# EAGLE design thtV1.0 (EAGLE 7.4.0)
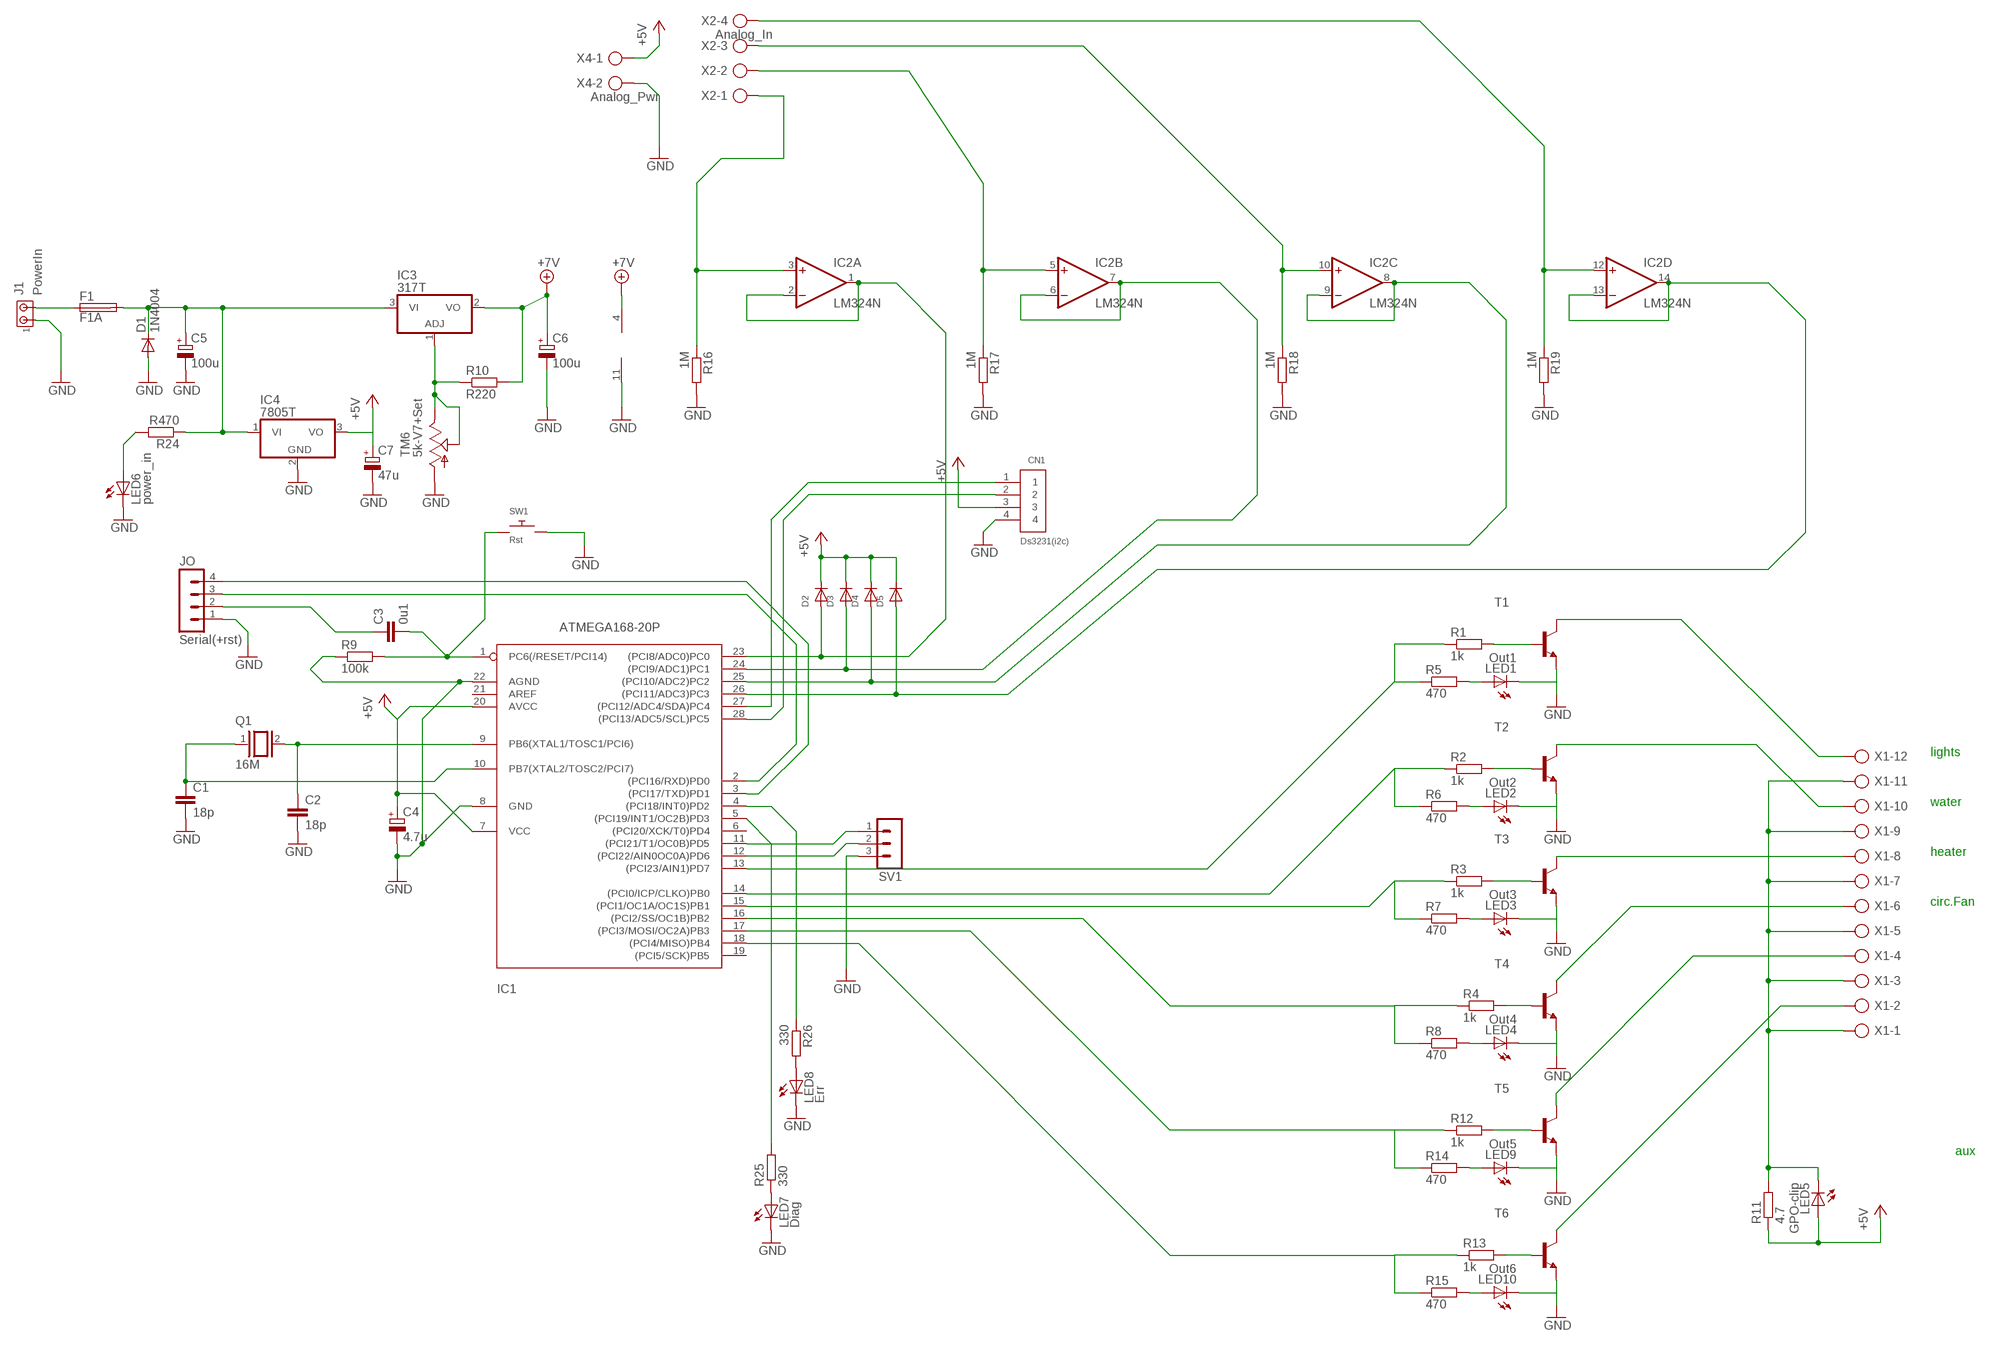
[diagram p0: schematic, sheet 1]

## Parts
C1  18p  C-EU025-024X044  [C025-024X044]
C2  18p  C-EU025-024X044  [C025-024X044]
C3  0u1  C-EU050-030X075  [C050-030X075]
C4  4.7u  CPOL-EUE5-10.5  [E5-10,5]
C5  100u  CPOL-EUE5-10.5  [E5-10,5]
C6  100u  CPOL-EUE3.5-8  [E3,5-8]
C7  47u  CPOL-EUE2,5-6E  [E2,5-6E]
CN1  Ds3231(i2c)  1X4-BIG  [1X04-BIG]
D1  1N4004  [DO41-10]
D2  DIODEDO-1N4148  [DO-1N4148]
D3  DIODEDO-1N4148  [DO-1N4148]
D4  DIODEDO-1N4148  [DO-1N4148]
D5  DIODEDO-1N4148  [DO-1N4148]
F1  F1A  GSH15  [GSH15]
IC1  ATMEGA168-20P  [DIL28-3]
IC2  LM324N  [DIL14]
IC3  317T  [TO220H]
IC4  7805T  [TO220H]
J1  PowerIn  MTA02-156  [1X2MTA]
JO  Serial(+rst)  MA04-1  [MA04-1]
LED1  Out1  LED3MM  [LED3MM]
LED2  Out2  LED3MM  [LED3MM]
LED3  Out3  LED3MM  [LED3MM]
LED4  Out4  LED3MM  [LED3MM]
LED5  GPO-clip  LED3MM  [LED3MM]
LED6  power_in  LED3MM  [LED3MM]
LED7  Diag  LED3MM  [LED3MM]
LED8  Err  LED3MM  [LED3MM]
LED9  Out5  LED3MM  [LED3MM]
LED10  Out6  LED3MM  [LED3MM]
Q1  16M  XTAL/S  [QS]
R1  1k  R-EU_0207/10  [0207/10]
R2  1k  R-EU_0207/10  [0207/10]
R3  1k  R-EU_0207/10  [0207/10]
R4  1k  R-EU_0207/10  [0207/10]
R5  470  R-EU_0204/2V  [0204V]
R6  470  R-EU_0204/2V  [0204V]
R7  470  R-EU_0204/2V  [0204V]
R8  470  R-EU_0204/2V  [0204V]
R9  100k  R-EU_0207/10  [0207/10]
R10  R220  R-EU_0207/10  [0207/10]
R11  4.7  R-EU_0207/10  [0207/10]
R12  1k  R-EU_0207/10  [0207/10]
R13  1k  R-EU_0207/10  [0207/10]
R14  470  R-EU_0204/2V  [0204V]
R15  470  R-EU_0204/2V  [0204V]
R16  1M  R-EU_0204/2V  [0204V]
R17  1M  R-EU_0204/2V  [0204V]
R18  1M  R-EU_0204/2V  [0204V]
R19  1M  R-EU_0204/2V  [0204V]
R24  R470  R-EU_0207/10  [0207/10]
R25  330  R-EU_0207/2V  [0207/2V]
R26  330  R-EU_0207/2V  [0207/2V]
SV1  MA03-1  [MA03-1]
SW1  Rst  SWITCH_PUSHBUTTONEVQ-PE  [TACT_PANA-EVQ]
T1  BC547A-NPN-TO92-CBE  [TO92-CBE]
T2  BC547A-NPN-TO92-CBE  [TO92-CBE]
T3  BC547A-NPN-TO92-CBE  [TO92-CBE]
T4  BC547A-NPN-TO92-CBE  [TO92-CBE]
T5  BC547A-NPN-TO92-CBE  [TO92-CBE]
T6  BC547A-NPN-TO92-CBE  [TO92-CBE]
TM6  5k-V7+Set  TRIM  [6MM]
X1  AK300/12  [AK300/12]
X2  Analog_In  AK300/4  [AK300/4]
X4  Analog_Pwr  AK300/2  [AK300/2]

## Nets
+5V: C4.+ C7.+ CN1.3 D2.C D3.C D4.C D5.C IC1.7(VCC) IC1.20(AVCC) IC4.3(VO) LED5.A R11.1 X4.1
+7V: C6.+ IC2.4(P:V+) IC3.2(VO) R10.2
GND: C1.2 C2.2 C4.- C5.- C6.- C7.- CN1.4 D1.A IC1.8(GND) IC1.22(AGND) IC2.11(P:V-) IC4.2(GND) J1.1 JO.1 LED1.K(C) LED2.K(C) LED3.K(C) LED4.K(C) LED6.K(C) LED7.K(C) LED8.K(C) LED9.K(C) LED10.K(C) R9.1 R16.2 R17.2 R18.2 R19.2 SV1.3 SW1.P$2 T1.E T2.E T3.E T4.E T5.E T6.E TM6.A X4.2
N$1: C2.1 IC1.9(PB6(XTAL1/TOSC1/PCI6)) Q1.2
N$2: C1.1 IC1.10(PB7(XTAL2/TOSC2/PCI7)) Q1.1
N$3: R4.2 T4.B
N$4: R3.2 T3.B
N$5: LED8.A R26.2
N$6: LED3.A R7.2
N$7: LED2.A R6.2
N$8: LED1.A R5.2
N$9: LED4.A R8.2
N$10: R1.2 T1.B
N$11: R2.2 T2.B
N$12: IC1.16((PCI2/SS/OC1B)PB2) R4.1 R8.1
N$13: IC2.10(C:+IN) R18.1 X2.3
N$14: IC1.15((PCI1/OC1A/OC1S)PB1) R3.1 R7.1
N$15: IC1.14((PCI0/ICP/CLKO)PB0) R2.1 R6.1
N$16: D3.A IC1.24((PCI9/ADC1)PC1) IC2.6(B:-IN) IC2.7(B:OUT)
N$17: IC1.5((PCI19/INT1/OC2B)PD3) R25.2
N$20: IC1.4((PCI18/INT0)PD2) R26.1
N$21: C3.1 JO.2
N$22: IC3.1(ADJ) R10.1 TM6.E TM6.S
N$24: IC1.2((PCI16/RXD)PD0) JO.3
N$25: IC1.3((PCI17/TXD)PD1) JO.4
N$27: F1.1 J1.2
N$29: C5.+ D1.C F1.2 IC3.3(VI) IC4.1(VI) R24.1
N$30: C3.2 IC1.1(PC6(/RESET/PCI14)) R9.2 SW1.P$1
N$32: R13.2 T6.B
N$33: R12.2 T5.B
N$34: T1.C X1.12
N$35: T2.C X1.10
N$36: T3.C X1.8
N$37: T4.C X1.6
N$38: LED5.K(C) R11.2 X1.1 X1.3 X1.5 X1.7 X1.9 X1.11
N$39: LED9.A R14.2
N$40: IC2.5(B:+IN) R17.1 X2.2
N$42: IC2.12(D:+IN) R19.1 X2.4
N$43: D2.A IC1.23((PCI8/ADC0)PC0) IC2.1(A:OUT) IC2.2(A:-IN)
N$44: LED10.A R15.2
N$45: D4.A IC1.25((PCI10/ADC2)PC2) IC2.8(C:OUT) IC2.9(C:-IN)
N$46: D5.A IC1.26((PCI11/ADC3)PC3) IC2.13(D:-IN) IC2.14(D:OUT)
N$47: IC1.18((PCI4/MISO)PB4) R13.1 R15.1
N$48: IC1.17((PCI3/MOSI/OC2A)PB3) R12.1 R14.1
N$49: IC2.3(A:+IN) R16.1 X2.1
N$50: T5.C X1.4
N$51: T6.C X1.2
N$52: LED6.A R24.2
N$53: LED7.A R25.1
N$54: CN1.1 IC1.27((PCI12/ADC4/SDA)PC4)
N$55: CN1.2 IC1.28((PCI13/ADC5/SCL)PC5)
N$56: IC1.11((PCI21/T1/OC0B)PD5) SV1.1
N$57: IC1.13((PCI23/AIN1)PD7) R1.1 R5.1
N$58: IC1.12((PCI22/AIN0OC0A)PD6) SV1.2
Unconnected: IC1.6((PCI20/XCK/T0)PD4) IC1.19((PCI5/SCK)PB5) IC1.21(AREF)

## Notes on the sheet
- lights
- water
- heater
- circ.Fan
- aux

## Library data of the parts
C1-C3 = resistor:C-EU: CAPACITOR, European symbol
C4-C7 = rcl:CPOL-EU: POLARIZED CAPACITOR, European symbol
CN1 = adafruit:1X4: 4-pin connector
D1 = adafruit:1N4004: DIODE General purpose 1N400x type rectifier (With bigger pads) http://www.ladyada.net/library/pcb/eaglelibrary.html
D2-D5 = adafruit:DIODE: Diode SMADIODE - SMA Surface Mount Package 20V 1A Schottky Diode Digikey: 641-1014-6-ND DO-1N4148 - Through Hole Small Current Diode SOD-123 20V 1 A (.5mV Vf) Schottky Diode - Digikey: MBRX120TPMSCT-ND SOD-323 10V 570mA (.38mV Vf, 3ns) Schottky Diode - Digikey: ZLLS410CT-ND SOD-523 30V 30mA Schottky Diode (RB751S-40TE61) - Digikey: RB751S-40TE61CT-ND SOT23-R/W - SOT23 Package (R = Solder Paste/Reflow Ovens, W = Hand-Soldering) BAT54Film 40V 300mA - Digikey: 497-7162-1-ND
F1 = fuse:GSH15: FUSE HOLDER grid 15mm, 19649 Wickmann; MPN: 64900001039; OC_FARNELL: 1271673; OC_NEWARK: 02P0318
IC1 = adafruit:ATMEGA168*P: MICROCONTROLLER 16 kBytes FLASH 1 kBytes SRAM 512 Bytes EEPROM USART 8-channel 10 bit ADC
IC2 = linear:LM324: OP AMP
IC3 = linear:*317: Positive VOLTAGE REGULATOR
IC4 = adafruit:78*: Positive VOLTAGE REGULATOR Added bigger pads to the TO-92 package
J1 = con-amp:MTA02-156: AMP connector
JO = con-lstb:MA04-1: PIN HEADER; OC_FARNELL: unknown; OC_NEWARK: unknown
LED1-LED10 = adafruit:LED: LED OSRAM: - CHIPLED LG R971, LG N971, LY N971, LG Q971, LY Q971, LO R971, LY R971 LH N974, LH R974 LS Q976, LO Q976, LY Q976 LO Q996 - Hyper CHIPLED LW Q18S LB Q993, LB Q99A, LB R99A - SideLED LS A670, LO A670, LY A670, LG A670, LP A670 LB A673, LV A673, LT A673, LW A673 LH A674 LY A675 LS A676, LA A676, LO A676, LY A676, LW A676 LS A679, LY A679, LG A679 - Hyper Micro SIDELED® LS Y876, LA Y876, LO Y876, LY Y876 LT Y87S - SmartLED LW L88C, LW L88S LB L89C, LB L89S, LG L890 LS L89K, LO L89K, LY L89K LS L896, LA L896, LO L896, LY L896 - TOPLED LS T670, LO T670, LY T670, LG T670, LP T670 LSG T670, LSP T670, LSY T670, LOP T670, LYG T670 LG T671, LOG T671, LSG T671 LB T673, LV T673, LT T673, LW T673 LH T674 LS T676, LA T676, LO T676, LY T676, LB T676, LH T676, LSB T676, LW T676 LB T67C, LV T67C, LT T67C, LS T67K, LO T67K, LY T67K, LW E67C LS E67B, LA E67B, LO E67B, LY E67B, LB E67C, LV E67C, LT E67C LW T67C LS T679, LY T679, LG T679 LS T770, LO T770, LY T770, LG T770, LP T770 LB T773, LV T773, LT T773, LW T773 LH T774 LS E675, LA E675, LY E675, LS T675 LS T776, LA T776, LO T776, LY T776, LB T776 LHGB T686 LT T68C, LB T68C - Hyper Mini TOPLED® LB M676 - Mini TOPLED Santana® LG M470 LS M47K, LO M47K, LY M47K Source: http://www.osram.convergy.de/
Q1 = special:XTAL/S: CRYSTAL
R1-R19 R24-R26 = rcl:R-EU_: RESISTOR, European symbol
SV1 = con-lstb:MA03-1: PIN HEADER; OC_FARNELL: unknown; OC_NEWARK: unknown
SW1 = adafruit:SWITCH_PUSHBUTTON: Buttons SOFTTOUCHSMD_SJ - Soft touch temporary push button (Super Junk Akihabara) Compatible with SKPMANE010 [Mouser: 688-SKPMAN] C&K_KSS = Digikey: KSS221GLFS
T1-T6 = transistor:*-NPN-: NPN Transistror BF959 corrected 2008.03.06
TM6 = adafruit:TRIM
X1 = con-ptr500:AK300/12: CONNECTOR; OC_FARNELL: unknown; OC_NEWARK: unknown
X2 = con-ptr500:AK300/4: CONNECTOR; OC_FARNELL: unknown; OC_NEWARK: unknown
X4 = con-ptr500:AK300/2: CONNECTOR; OC_FARNELL: unknown; OC_NEWARK: unknown

## Board
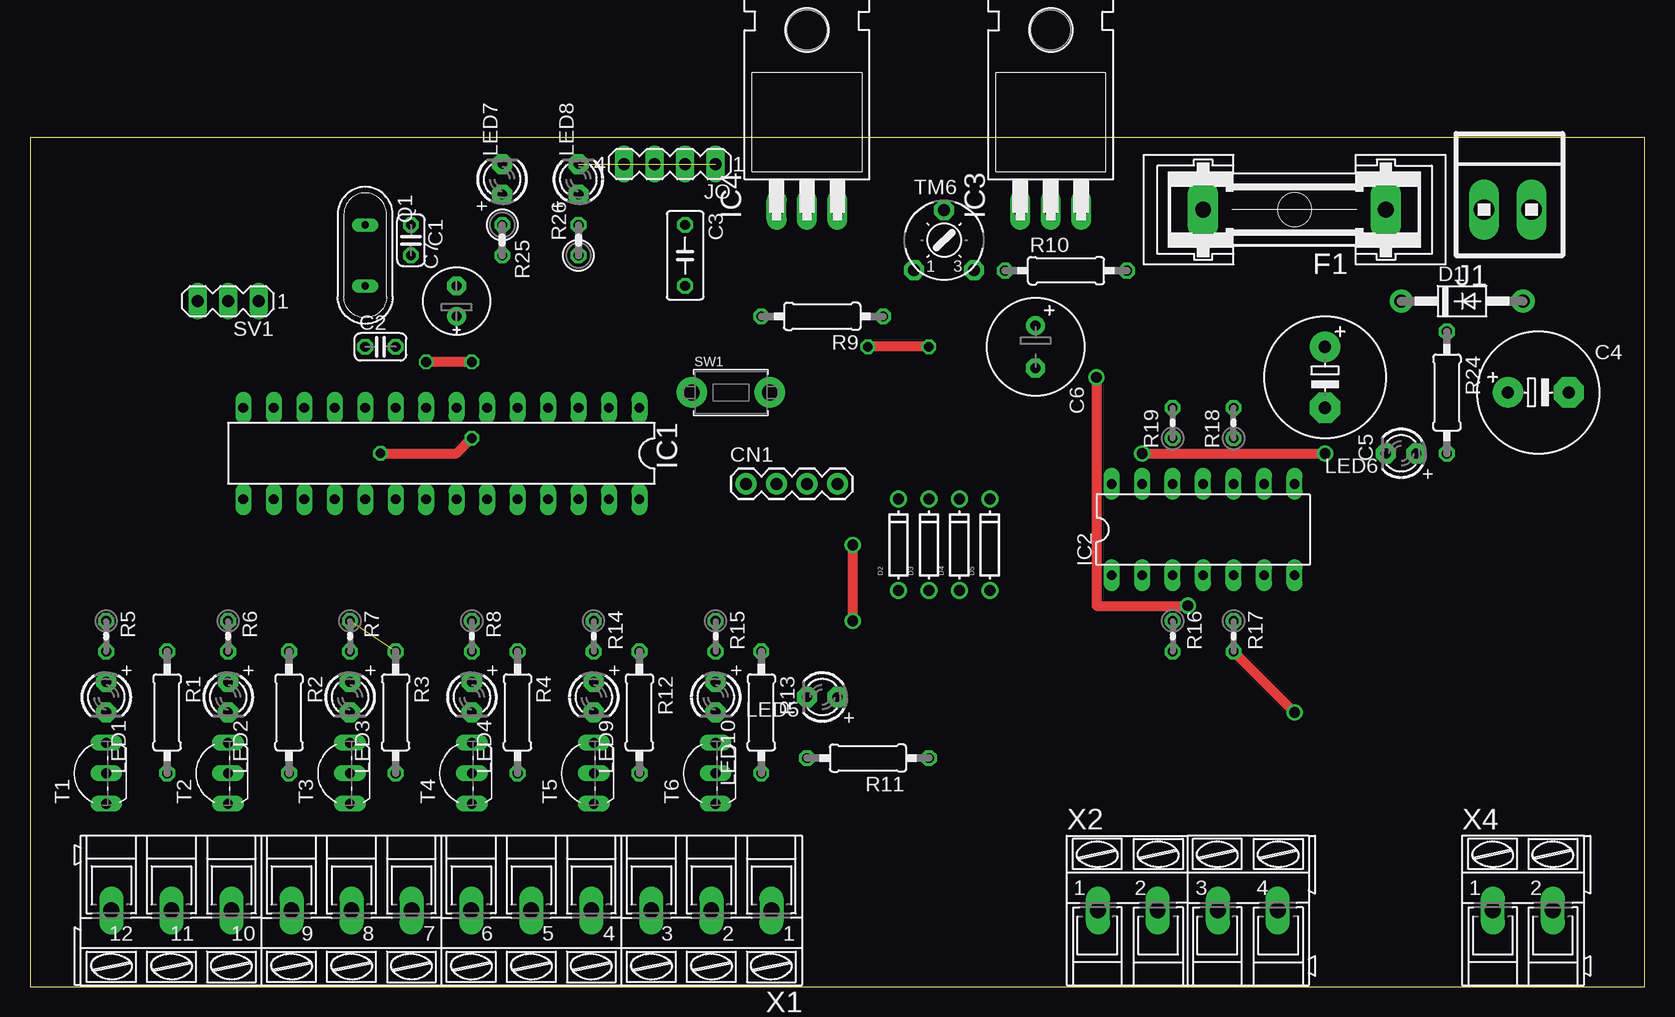
[diagram p1: board, top side]
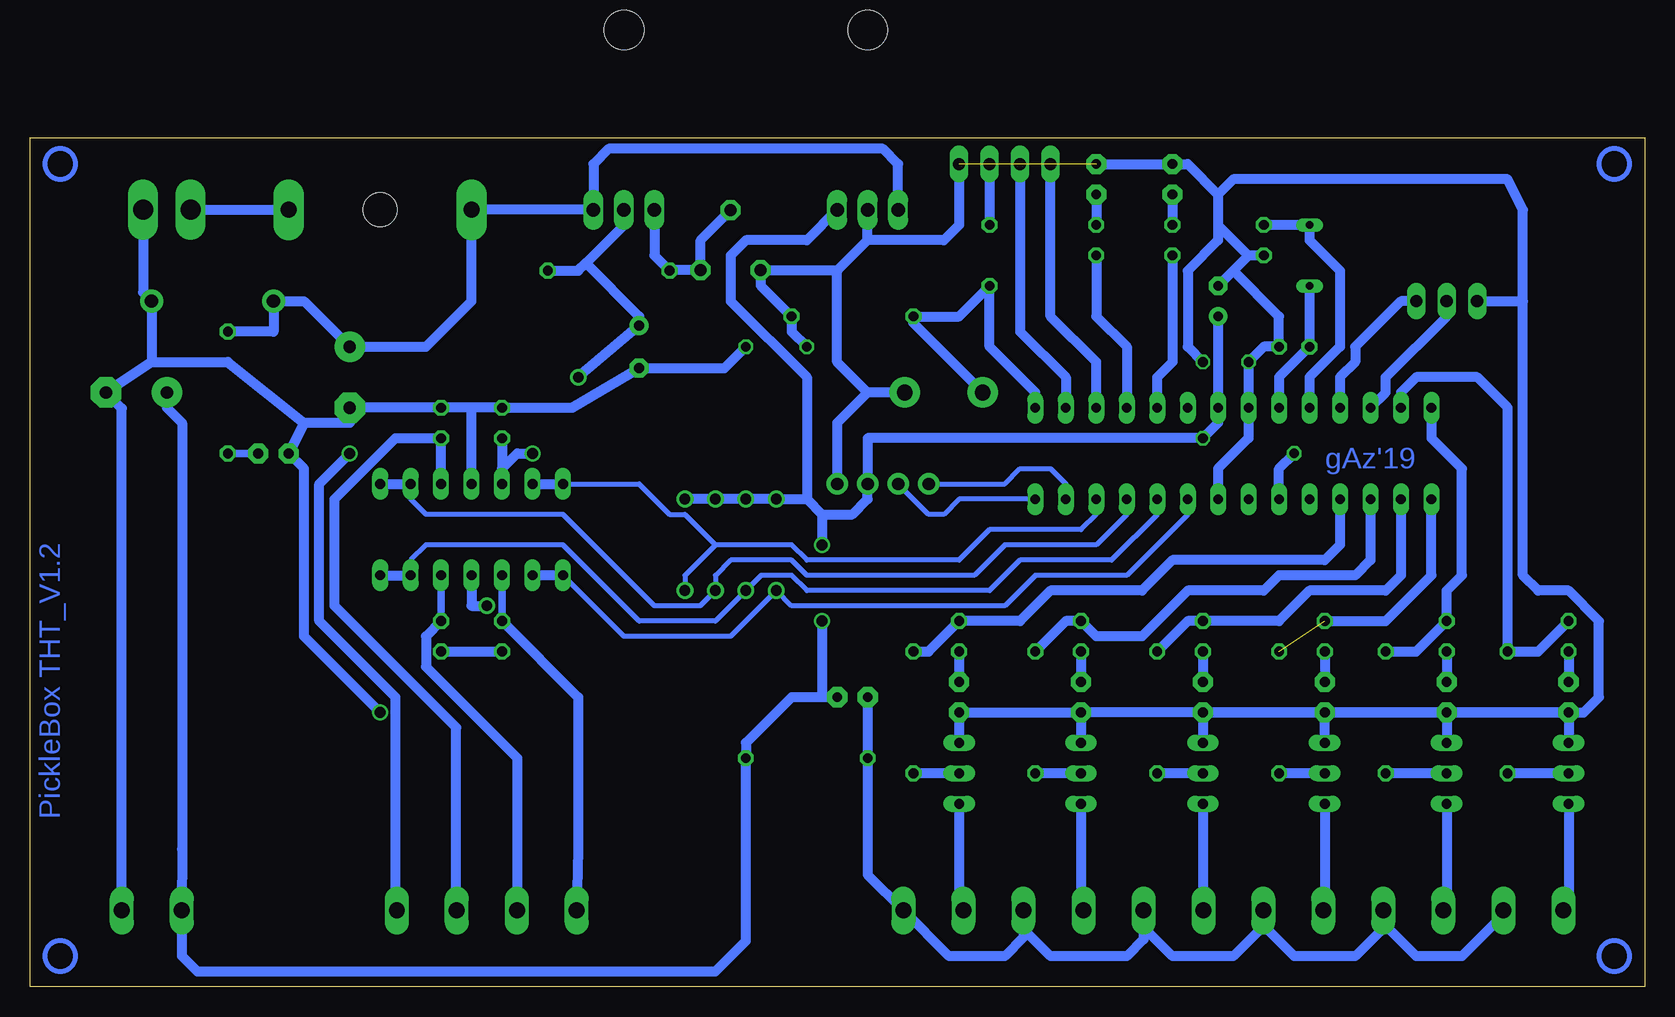
[diagram p2: board, bottom side, seen from below]

Size 134.6 x 70.79 mm. Coordinates in mm from the lower left corner, seen from the top.
Outline: 0,0 134.6,0 134.6,70.79 0,70.79 0,0
Copper layers (1*16): Top 0.035mm / dielectric 1.5mm / Bottom 0.035mm
Design rules "default": minimum track width 10mil, minimum drill 24mil, track to track 8mil, track to pad 8mil, pad to pad 8mil, via to via 8mil, smd to smd 8mil, copper to edge 40mil, drill to drill 8mil, minimum pad ring 10mil, minimum via ring 8mil, stop-mask expansion 4mil, vias tented up to drill 0mil, thermal gap 10mil

### Footprints (pad centres in the part's own frame; a part is rotated, then mirrored left to right if it is on the bottom)
C025-024X044 = drill 0.813 octagon: 1 -1.27,0; 2 1.27,0
C050-030X075 = drill 0.813 octagon: 1 -2.54,0; 2 2.54,0
E5-10,5 = drill 1.016 pad 2.54: + -2.54,0 | drill 1.016 pad 2.54 octagon: - 2.54,0
E3,5-8 = drill 0.813 pad 1.6: + -1.778,0 | drill 0.813 pad 1.6 octagon: - 1.778,0
E2,5-6E = drill 0.813 pad 1.575: + -1.27,0 | drill 0.813 pad 1.575 octagon: - 1.27,0
1X04-BIG = drill 1.016 pad 1.778: 1 0,0; 2 2.54,0; 3 5.08,0; 4 7.62,0
DO41-10 = drill 1.118 pad 1.93: A 5.08,0; C -5.08,0
DO-1N4148 = drill 0.9: A -3.81,0; C 3.81,0
GSH15 = drill 1.321 pad 2.54 long: 1 -7.62,0; 2 7.62,0 | hole 2.794: 0,0
DIL28-3 = drill 0.813 long: 1 -16.51,-3.81; 2 -13.97,-3.81; 3 -11.43,-3.81; 4 -8.89,-3.81; 5 -6.35,-3.81; 6 -3.81,-3.81; 7 -1.27,-3.81; 8 1.27,-3.81; 9 3.81,-3.81; 10 6.35,-3.81; 11 8.89,-3.81; 12 11.43,-3.81; 13 13.97,-3.81; 14 16.51,-3.81; 15 16.51,3.81; 16 13.97,3.81; 17 11.43,3.81; 18 8.89,3.81; 19 6.35,3.81; 20 3.81,3.81; 21 1.27,3.81; 22 -1.27,3.81; 23 -3.81,3.81; 24 -6.35,3.81; 25 -8.89,3.81; 26 -11.43,3.81; 27 -13.97,3.81; 28 -16.51,3.81
DIL14 = drill 0.813 long: 1 -7.62,-3.81; 2 -5.08,-3.81; 3 -2.54,-3.81; 4 0,-3.81; 5 2.54,-3.81; 6 5.08,-3.81; 7 7.62,-3.81; 8 7.62,3.81; 9 5.08,3.81; 10 2.54,3.81; 11 0,3.81; 12 -2.54,3.81; 13 -5.08,3.81; 14 -7.62,3.81
TO220H = drill 1.118 long: 1 -2.54,-10.16; 2 0,-10.16; 3 2.54,-10.16 | hole 3.302: 0,4.826
1X2MTA = drill 1.676 long: 1 1.981,0; 2 -1.981,0
MA04-1 = drill 1.016 long: 1 -3.81,0; 2 -1.27,0; 3 1.27,0; 4 3.81,0
LED3MM = drill 0.813 pad 1.676 octagon: A -1.27,0; K 1.27,0
QS = drill 0.61 long: 1 -2.54,0; 2 2.54,0
0207/10 = drill 0.813 octagon: 1 -5.08,0; 2 5.08,0
0204V = drill 0.813 octagon: 1 -1.27,0; 2 1.27,0
0207/2V = drill 0.813 octagon: 1 -1.27,0; 2 1.27,0
MA03-1 = drill 1.016 long: 1 -2.54,0; 2 0,0; 3 2.54,0
TACT_PANA-EVQ = drill 1.3 pad 2.54: P$1 -3.25,0; P$2 3.25,0
TO92-CBE = drill 0.813 long: B 0,0; C -2.54,0; E 2.54,0
6MM = drill 1 pad 1.676 octagon: A -2.5,-2.5; E 2.5,-2.5; S 0,2.5
AK300/12 = drill 1.321 long: 1 -27.508,0; 2 -22.504,0; 3 -17.501,0; 4 -12.497,0; 5 -7.493,0; 6 -2.489,0; 7 2.489,0; 8 7.493,0; 9 12.497,0; 10 17.501,0; 11 22.504,0; 12 27.508,0
AK300/4 = drill 1.321 long: 1 -7.493,0; 2 -2.515,0; 3 2.515,0; 4 7.493,0
AK300/2 = drill 1.321 long: 1 -2.515,0; 2 2.489,0

### Placement (x,y rotation side)
C1  31.75,62.23 270 top
C2  29.21,53.34 0 top
C3  54.61,60.96 270 top
C4  125.73,49.53 0 top
C5  107.95,50.8 270 top
C6  83.82,53.34 270 top
C7  35.56,57.15 90 top
CN1  59.69,41.91 0 top
D1  119.38,57.15 0 top
D2  72.39,36.83 90 top
D3  74.93,36.83 90 top
D4  77.47,36.83 90 top
D5  80.01,36.83 90 top
F1  105.41,64.77 180 top
IC1  34.29,44.45 180 top
IC2  97.79,38.1 0 top
IC3  85.09,74.93 0 top
IC4  64.77,74.93 0 top
J1  123.19,64.77 0 top
JO  53.34,68.58 180 top
LED1  6.35,24.13 270 top
LED2  16.51,24.13 270 top
LED3  26.67,24.13 270 top
LED4  36.83,24.13 270 top
LED5  66.04,24.13 180 top
LED6  114.3,44.45 180 top
LED7  39.37,67.31 90 top
LED8  45.72,67.31 90 top
LED9  46.99,24.13 270 top
LED10  57.15,24.13 270 top
Q1  27.94,60.96 270 top
R1  11.43,22.86 270 top
R2  21.59,22.86 270 top
R3  30.48,22.86 270 top
R4  40.64,22.86 270 top
R5  6.35,29.21 270 top
R6  16.51,29.21 270 top
R7  26.67,29.21 270 top
R8  36.83,29.21 270 top
R9  66.04,55.88 180 top
R10  86.36,59.69 0 top
R11  69.85,19.05 180 top
R12  50.8,22.86 270 top
R13  60.96,22.86 270 top
R14  46.99,29.21 270 top
R15  57.15,29.21 270 top
R16  95.25,29.21 270 top
R17  100.33,29.21 270 top
R18  100.33,46.99 90 top
R19  95.25,46.99 90 top
R24  118.11,49.53 270 top
R25  39.37,62.23 270 top
R26  45.72,62.23 90 top
SV1  16.51,57.15 180 top
SW1  58.42,49.53 0 top
T1  6.35,17.78 90 top
T2  16.51,17.78 90 top
T3  26.67,17.78 90 top
T4  36.83,17.78 90 top
T5  46.99,17.78 90 top
T6  57.15,17.78 90 top
TM6  76.2,62.23 0 top
X1  34.29,6.35 180 top
X2  96.52,6.35 0 top
X4  124.46,6.35 0 top

### Tracks (layer width: path | path; a pad name or v marks a point on that pad's centre or on a via)
+5V  (via drill 0.8, 0.9)
  Top 0.813: v29.21,44.45 35.56,44.45 v36.83,45.72 | v68.58,36.83 v68.58,30.48
  Bottom 0.813: IC1.20 30.48,43.18 v29.21,44.45 | C7.+ IC1.7 35.56,46.99 v36.83,45.72 64.77,45.72 CN1.3 64.77,40.64 66.04,39.37 68.58,39.37 | IC4.3 69.85,62.23 74.93,62.23 76.2,60.96 76.2,57.15 69.85,50.8 69.85,40.64 | D5.C D4.C D3.C D2.C 69.85,40.64 | 69.85,40.64 68.58,39.37 | C4.+ 123.19,48.26 121.92,46.99 121.92,11.45 X4.1 121.95,2.56 120.65,1.27 77.47,1.27 74.93,3.81 R11.1 74.93,20.32 71.12,24.13 68.58,24.13 | LED5.A 68.58,24.13 | v68.58,30.48 68.58,24.13 | 68.58,39.37 v68.58,36.83
+7V  (via drill 0.9)
  Top 0.813: v88.9,50.8 88.9,31.75 v96.52,31.75
  Bottom 0.813: R10.2 88.9,59.69 88.27,60.32 | 88.27,60.32 85.09,63.5 IC3.2 | 88.27,60.32 83.82,55.88 C6.+ v88.9,50.8 | IC2.4 97.79,31.75 v96.52,31.75
GND  (via drill 0.8, 0.9)  (1 unrouted)
  Top 0.813: v36.83,52.07 v33.02,52.07 | v74.93,53.34 v69.85,53.34 | R17.2 v105.41,22.86
  Bottom 0.61: 97.79,48.26 C5.-
  Bottom 0.813: T1.E LED1.K LED2.K | LED2.K LED3.K | LED2.K T2.E | LED4.K T4.E | C1.2 33.02,60.96 | 33.02,60.96 34.29,59.69 | 34.29,59.69 C7.- | 34.29,59.69 30.48,55.88 C2.2 31.75,53.34 v33.02,52.07 IC1.8 33.02,45.72 35.56,43.18 IC1.22 | 35.56,63.5 33.02,60.96 | LED8.K LED7.K 38.1,68.58 35.56,66.04 | 35.56,66.04 35.56,63.5 | 35.56,63.5 35.56,62.23 38.1,59.69 38.1,53.34 v36.83,52.07 | 67.27,59.73 TM6.A 73.7,58.46 R9.1 71.12,54.61 v69.85,53.34 | 67.27,59.73 64.77,62.23 | 64.77,62.23 IC4.2 | JO.1 57.15,63.5 58.42,62.23 64.77,62.23 | 67.27,59.73 67.31,59.69 67.31,52.07 64.77,49.53 | SW1.P$2 64.77,49.53 | 64.77,49.53 67.31,46.99 CN1.4 | v74.93,53.34 76.71,51.56 C6.- 89.41,48.26 R19.2 97.79,48.26 | J1.1 125.17,57.86 D1.A 124.46,52.07 | 124.46,52.07 C4.- 126.95,48.21 X4.2 | 124.46,52.07 118.11,52.07 111.76,46.99 | 111.76,46.99 LED6.K 111.76,43.18 111.76,29.21 v105.41,22.86 | 111.76,46.99 107.95,46.99 C5.- R18.2 97.79,48.26 | IC2.11 97.79,48.26 | R17.2 R16.2 | T3.E LED3.K | LED3.K LED4.K | LED4.K LED9.K | LED9.K LED10.K T6.E | LED9.K T5.E | LED4.K 5.08,22.86 3.81,24.13 3.81,30.48 6.35,33.02 8.89,33.02 10.16,34.29 10.16,57.15 | 10.16,57.15 10.16,64.77 11.43,67.31 34.29,67.31 35.56,66.04 | SV1.3 10.16,57.15
N$1
  Bottom 0.813: IC1.9 30.48,50.8 C2.1 Q1.2
N$2
  Bottom 0.813: C1.1 Q1.1 27.94,62.23 25.4,59.69 25.4,53.34 27.94,50.8 IC1.10
N$3
  Bottom 0.813: T4.B R4.2
N$4
  Bottom 0.813: T3.B R3.2
N$5
  Bottom 0.813: LED8.A R26.2
N$6
  Bottom 0.813: R7.2 LED3.A
N$7
  Bottom 0.813: R6.2 LED2.A
N$8
  Bottom 0.813: R5.2 LED1.A
N$9
  Bottom 0.813: R8.2 LED4.A
N$10
  Bottom 0.813: T1.B R1.2
N$11
  Bottom 0.813: T2.B R2.2
N$12
  Bottom 0.813: R4.1 38.1,30.48 R8.1 30.48,30.48 27.94,33.02 21.59,33.02 20.32,34.29 IC1.16
N$13
  Bottom 0.813: IC2.10 R18.1 104.14,45.72 109.22,40.64 109.22,31.75 99.06,21.59 99.06,6.35 X2.3
N$14  (1 unrouted)
  Bottom 0.813: R7.1 21.59,30.48 17.78,34.29 IC1.15
N$15
  Bottom 0.813: IC1.14 17.78,45.72 15.24,43.18 15.24,34.29 16.51,33.02 R6.1 19.05,27.94 R2.1
N$16
  Bottom 0.406: IC1.24 40.64,39.37 44.45,35.56 52.07,35.56 54.61,33.02 69.85,33.02 71.12,34.29 73.66,34.29 D3.A 77.47,30.48 83.82,30.48 90.17,36.83 101.6,36.83 102.87,35.56 IC2.6
  Bottom 0.813: IC2.7 IC2.6
N$17
  Bottom 0.813: R25.2 39.37,52.07 40.64,50.8 IC1.5
N$19  (via drill 0.8)
  other vias: 74.93,53.34
N$20
  Bottom 0.813: R26.1 45.72,55.88 43.18,53.34 IC1.4
N$21
  Bottom 0.813: JO.2 C3.1
N$22
  Bottom 0.813: TM6.S 78.7,62.23 TM6.E 81.24,59.73 R10.1 82.55,60.96 IC3.1
N$24
  Bottom 0.813: JO.3 52.07,54.61 48.26,50.8 IC1.2
N$25
  Bottom 0.813: IC1.3 45.72,52.07 49.53,55.88 JO.4
N$27
  Bottom 0.813: J1.2 F1.1
N$29
  Bottom 0.813: IC4.1 62.23,68.58 63.5,69.85 86.36,69.85 87.63,68.58 IC3.3 F1.2 97.79,57.15 101.6,53.34 C5.+ 111.76,57.15 D1.C 114.3,54.61 R24.1
N$30
  Bottom 0.813: IC1.1 50.8,49.53 54.61,53.34 C3.2 57.15,55.88 R9.2 60.96,55.32 SW1.P$1
N$32
  Bottom 0.813: T6.B R13.2
N$33
  Bottom 0.813: T5.B R12.2
N$34
  Bottom 0.813: T1.C 6.35,6.78 X1.12
N$35
  Bottom 0.813: T2.C 16.51,6.63 X1.10
N$36
  Bottom 0.813: T3.C 26.67,6.48 X1.8
N$37
  Bottom 0.813: T4.C 36.83,6.4 X1.6
N$38
  Bottom 0.813: LED5.K R11.2 64.77,9.32 X1.1 57.99,2.54 53.34,2.54 51.79,4.09 X1.3 52.07,6.07 52.07,5.08 49.53,2.54 43.18,2.54 41.78,3.94 X1.5 41.91,6.22 41.91,5.08 39.37,2.54 34.29,2.54 31.8,5.03 X1.7 31.75,6.3 31.75,5.08 29.21,2.54 24.13,2.54 21.79,4.88 X1.9 21.59,6.15 21.59,5.08 19.05,2.54 15.24,2.54 11.79,5.99 X1.11
N$39
  Bottom 0.813: R14.2 LED9.A
N$40
  Bottom 0.61: IC2.5 R17.1
  Bottom 0.813: R17.1 101.6,29.21 101.6,26.67 93.98,19.05 93.98,6.35 X2.2
N$41  (via drill 0.9)
  other vias: 92.71,44.45
N$42  (via drill 0.9)
  Top 0.813: v92.71,44.45 v107.95,44.45
  Bottom 0.813: R19.1 IC2.12 95.25,43.18 93.98,44.45 v92.71,44.45 | X2.4 104.14,6.35 104.14,24.13 110.49,30.48 110.49,41.91 v107.95,44.45
N$43
  Bottom 0.406: IC1.23 38.1,39.37 43.18,34.29 50.8,34.29 53.34,31.75 71.12,31.75 D2.A 76.2,29.21 85.09,29.21 IC2.1
  Bottom 0.813: IC2.1 IC2.2
N$44
  Bottom 0.813: R15.2 LED10.A
N$45
  Bottom 0.406: IC1.25 43.18,39.37 45.72,36.83 53.34,36.83 55.88,34.29 69.85,34.29 71.12,35.56 76.2,35.56 77.47,34.29 D4.A 78.74,31.75 82.55,31.75 90.17,39.37 101.6,39.37 102.87,40.64 IC2.9
  Bottom 0.813: IC2.8 IC2.9
N$46
  Bottom 0.406: IC1.26 45.72,39.37 46.99,38.1 54.61,38.1 57.15,35.56 69.85,35.56 71.12,36.83 77.47,36.83 | 77.47,36.83 80.01,34.29 D5.A | IC2.14 83.82,41.91 81.28,39.37 80.01,39.37 77.47,36.83
  Bottom 0.813: IC2.13 IC2.14
N$47
  Bottom 0.813: R13.1 59.69,27.94 R15.1 52.07,30.48 49.53,33.02 41.91,33.02 39.37,35.56 26.67,35.56 25.4,36.83 IC1.18
N$48
  Bottom 0.813: IC1.17 22.86,35.56 24.13,34.29 30.48,34.29 31.75,33.02 38.1,33.02 41.91,29.21 45.72,29.21 R14.1 48.26,30.48 R12.1
N$49
  Bottom 0.61: IC2.3 R16.1
  Bottom 0.813: R16.1 88.9,24.13 88.9,11.43 X2.1
N$50
  Bottom 0.813: T5.C 46.99,6.55 X1.4
N$51
  Bottom 0.813: T6.C 57.15,6.71 X1.2
N$52
  Bottom 0.61: R24.2 LED6.A
N$53
  Bottom 0.813: LED7.A R25.1
N$54
  Bottom 0.406: CN1.1 53.34,41.91 52.07,43.18 49.53,43.18 48.26,41.91 IC1.27
N$55
  Bottom 0.406: IC1.28 57.15,40.64 58.42,39.37 59.69,39.37 CN1.2
N$56
  Bottom 0.813: SV1.1 20.32,57.15 24.13,53.34 24.13,52.07 25.4,50.8 IC1.11
N$57
  Bottom 0.813: R5.1 8.89,27.94 R1.1 11.43,48.26 13.97,50.8 19.05,50.8 20.32,49.53 IC1.13
N$58
  Bottom 0.813: SV1.2 16.51,55.88 21.59,50.8 21.59,49.53 IC1.12
(copper drawn outside any net)
  shapes: Bottom circle x4

### Text on the board
Bottom: gAz'19 | PickleBox THT_V1.2